# Altium schematic sheet Gating.SchDoc
size A; SheetNumber: 4; SheetTotal: 6
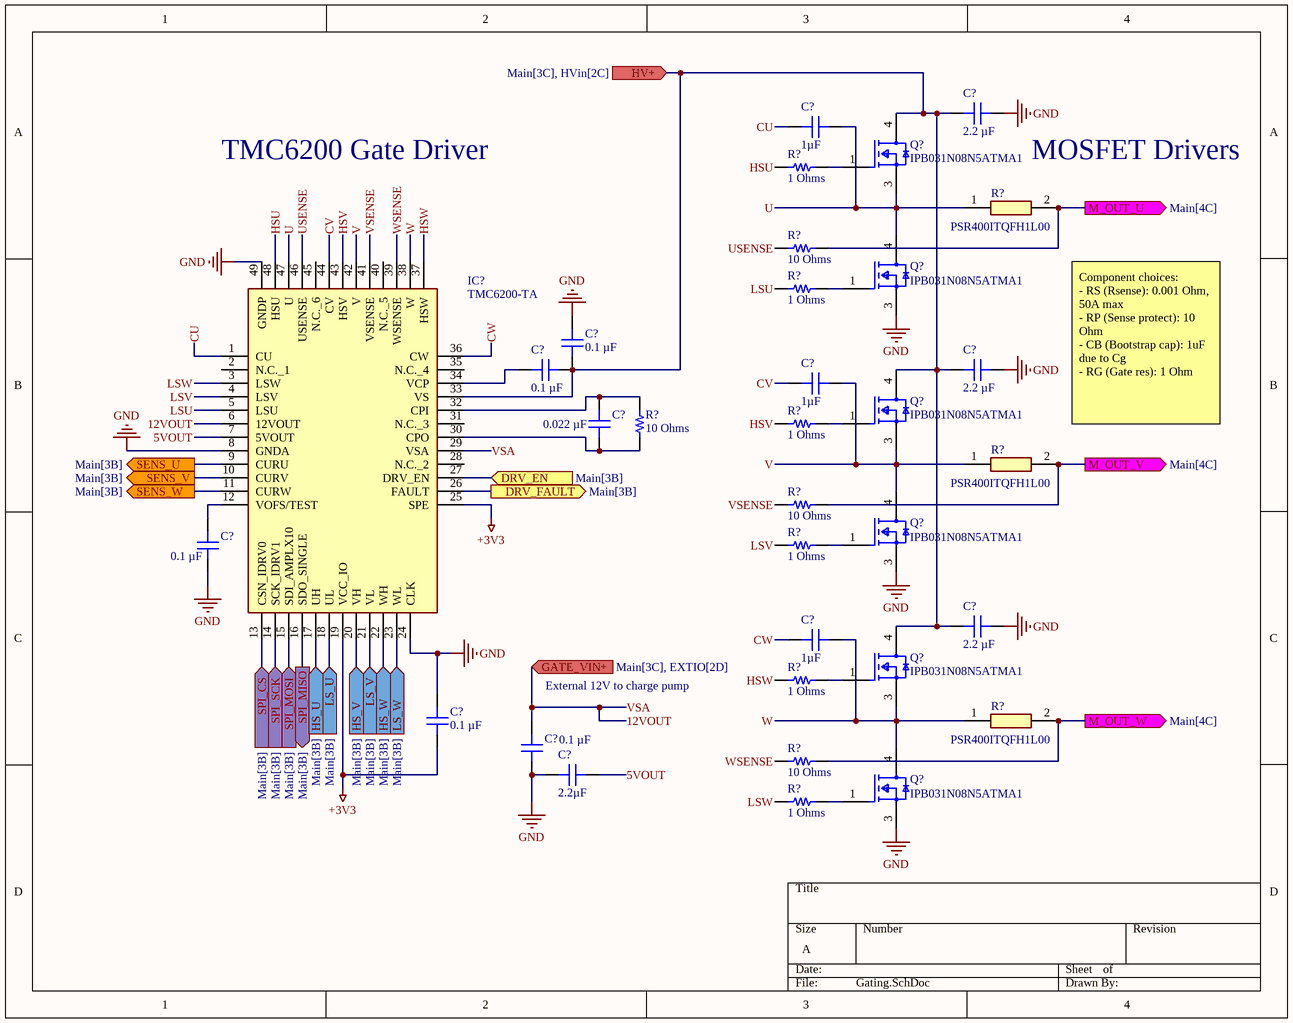
[diagram p0: Gating.SchDoc]

## Parts
(Parts that share a designator on the sheet are numbered #1, #2 ... from top to bottom, then left to right.)
C?#1  2.2 µF  [CAP 0805_2012]
C?#2  1µF  [CAP 1210_3225 - 2.8MM]
C?#3  0.1 µF  [CAP 1206_3216 - 0.8MM]
C?#4  0.1 µF  [CAP 1206_3216 - 0.8MM]
C?#5  2.2 µF  [CAP 0805_2012]
C?#6  1µF  [CAP 1210_3225 - 2.8MM]
C?#7  0.022 µF  [CAP 1206_3216 - 0.8MM]
C?#8  0.1 µF  [CAP 0603_1608]
C?#9  2.2 µF  [CAP 0805_2012]
C?#10  1µF  [CAP 1210_3225 - 2.8MM]
C?#11  0.1 µF  [CAP 0603_1608]
C?#12  0.1 µF  [CAP 1206_3216 - 0.8MM]
C?#13  2.2µF  [CAP 1206_3216 - 1.2MM]
IC?  TMC6200-TA  [QFP50P900X900X120-49N]
Q?#1  IPB031N08N5ATMA1  [FP-PG-TO263-3-MFG]
Q?#2  IPB031N08N5ATMA1  [FP-PG-TO263-3-MFG]
Q?#3  IPB031N08N5ATMA1  [FP-PG-TO263-3-MFG]
Q?#4  IPB031N08N5ATMA1  [FP-PG-TO263-3-MFG]
Q?#5  IPB031N08N5ATMA1  [FP-PG-TO263-3-MFG]
Q?#6  IPB031N08N5ATMA1  [FP-PG-TO263-3-MFG]
R?#1  1 Ohms  [RES 1210_3225]
R?#2  PSR400ITQFH1L00  [RESC10052X105N]
R?#3  10 Ohms  [RES 1210_3225]
R?#4  1 Ohms  [RES 1210_3225]
R?#5  10 Ohms  [RES 0603_1608]
R?#6  1 Ohms  [RES 1210_3225]
R?#7  PSR400ITQFH1L00  [RESC10052X105N]
R?#8  10 Ohms  [RES 1210_3225]
R?#9  1 Ohms  [RES 1210_3225]
R?#10  1 Ohms  [RES 1210_3225]
R?#11  PSR400ITQFH1L00  [RESC10052X105N]
R?#12  10 Ohms  [RES 1210_3225]
R?#13  1 Ohms  [RES 1210_3225]

## Ports
DRV_EN (in, see Main[3B]), DRV_FAULT (out, see Main[3B]), GATE_VIN+ (in, see Main[3C], EXTIO[2D]), HS_U (in, see Main[3B]), HS_V (in, see Main[3B]), HS_W (in, see Main[3B]), HV+ (in, see Main[3C], HVin[2C]), LS_U (in, see Main[3B]), LS_V (in, see Main[3B]), LS_W (in, see Main[3B]), M_OUT_U (out, see Main[4C]), M_OUT_V (out, see Main[4C]), M_OUT_W (out, see Main[4C]), SENS_U (out, see Main[3B]), SENS_V (out, see Main[3B]), SENS_W (out, see Main[3B]), SPI_CS (in, see Main[3B]), SPI_MISO (out, see Main[3B]), SPI_MOSI (in, see Main[3B]), SPI_SCK (in, see Main[3B])

## Nets
+3V3: C?#11.1 IC?.19(VCC_IO) IC?.25(SPE)
GND: C?#1.1 C?#3.2 C?#5.1 C?#8.1 C?#9.1 C?#11.2 C?#12.1 C?#13.1 IC?.8(GNDA) IC?.24(CLK) IC?.49(GNDP) Q?#2.3(S) Q?#4.3(S) Q?#6.3(S)
5VOUT: C?#13.2 IC?.7(5VOUT)
12VOUT: C?#12.2 IC?.6(12VOUT) IC?.29(VSA) ; port GATE_VIN+  [also labelled VSA]
CU: C?#2.1 IC?.1(CU)
CV: C?#6.1 IC?.44(CV)
CW: C?#10.1 IC?.36(CW)
DRV_EN: IC?.27(DRV_EN) ; port DRV_EN
DRV_FAULT: IC?.26(FAULT) ; port DRV_FAULT
HS_U: IC?.17(UH) ; port HS_U
HS_V: IC?.20(VH) ; port HS_V
HS_W: IC?.22(WH) ; port HS_W
HSU: IC?.48(HSU) R?#1.1
HSV: IC?.43(HSV) R?#6.1
HSW: IC?.37(HSW) R?#10.1
HV+: C?#1.2 C?#3.1 C?#4.2 C?#5.2 C?#9.2 IC?.33(VS) Q?#1.4(D) Q?#3.4(D) Q?#5.4(D) ; port HV+
LS_U: IC?.18(UL) ; port LS_U
LS_V: IC?.21(VL) ; port LS_V
LS_W: IC?.23(WL) ; port LS_W
LSU: IC?.5(LSU) R?#4.1
LSV: IC?.4(LSV) R?#9.1
LSW: IC?.3(LSW) R?#13.1
M_OUT_U: R?#2.2 R?#3.2 ; port M_OUT_U
M_OUT_V: R?#7.2 R?#8.2 ; port M_OUT_V
M_OUT_W: R?#11.2 R?#12.2 ; port M_OUT_W
SENS_U: IC?.9(CURU) ; port SENS_U
SENS_V: IC?.10(CURV) ; port SENS_V
SENS_W: IC?.11(CURW) ; port SENS_W
SPI_CS: IC?.13(CSN_IDRV0) ; port SPI_CS
SPI_MISO: IC?.16(SDO_SINGLE) ; port SPI_MISO
SPI_MOSI: IC?.15(SDI_AMPLX10) ; port SPI_MOSI
SPI_SCK: IC?.14(SCK_IDRV1) ; port SPI_SCK
U: C?#2.2 IC?.47(U) Q?#1.3(S) Q?#2.4(D) R?#2.1
USENSE: IC?.46(USENSE) R?#3.1
V: C?#6.2 IC?.42(V) Q?#3.3(S) Q?#4.4(D) R?#7.1
VSENSE: IC?.41(VSENSE) R?#8.1
W: C?#10.2 IC?.38(W) Q?#5.3(S) Q?#6.4(D) R?#11.1
WSENSE: IC?.39(WSENSE) R?#12.1
NetC?#4_1: C?#4.1 IC?.34(VCP)
NetC?#7_1: C?#7.1 IC?.30(CPO) R?#5.1
NetC?#7_2: C?#7.2 IC?.32(CPI) R?#5.2
NetC?#8_2: C?#8.2 IC?.12(VOFS/TEST)
NetQ?#1_1: Q?#1.1(G) R?#1.2
NetQ?#2_1: Q?#2.1(G) R?#4.2
NetQ?#3_1: Q?#3.1(G) R?#6.2
NetQ?#4_1: Q?#4.1(G) R?#9.2
NetQ?#5_1: Q?#5.1(G) R?#10.2
NetQ?#6_1: Q?#6.1(G) R?#13.2

Not connected (* = marked no-connect by the designer): IC? 2(N.C._1) 28(N.C._2) 31(N.C._3) 35(N.C._4) 40(N.C._5) 45(N.C._6)

## Notes on the sheet
- TMC6200 Gate Driver
- MOSFET Drivers
- Component choices:
  - RS (Rsense): 0.001 Ohm, 50A max
  - RP (Sense protect): 10 Ohm
  - CB (Bootstrap cap): 1uF due to Cg
  - RG (Gate res): 1 Ohm
- (near C?#12) External 12V to charge pump

## Library data of the parts
C?#1 C?#5 C?#9 = GRM21BD72A225KE01L: CAP CER 2.2UF 100V X7T 0805; manufacturer: Murata Electronics; Tolerance: ±10%; Part Number: GRM21BD72A225KE01L; Value: 2.2 µF; Applications: General Purpose; Capacitance: 2.2 µF; componentlink1description: Datasheet; componentlink1url: https://search.murata.co.jp/Ceramy/image/img/A01X/G101/ENG/GRM21BD72A225KE01-01A.pdf; componentlink2description: DigiKey Link; componentlink2url: https://www.digikey.com/en/products/detail/murata-electronics/GRM21BD72A225KE01L/16033492; Device Package: 0805 (2012 Metric); lastupdated: 2/6/2023 8:10:57 PM; Lifecycle Status: Active; Minimum Order: 1; Mounting Type: Surface Mount, MLCC; Operating Temperature: -55°C ~ 125°C; Package / Case: 0805 (2012 Metric); packaging: TapeAndReel; partid: 42420; Part Status: Active; price: 0.13; series: GRM; Size / Dimension: 0.079" L x 0.049" W (2.00mm x 1.25mm); Supplier 1: DigiKey; Supplier Part Number 1: 490-GRM21BD72A225KE01LCT-ND; Temperature Coefficient: X7T; Thickness (Max): 0.057" (1.45mm); Voltage - Rated: 100V
C?#2 C?#6 C?#10 = 12101C105MAT2A: CAP CER 1UF 100V X7R 1210; manufacturer: AVX Corporation; Tolerance: ±20%; Part Number: 12101C105MAT2A; Value: 1µF; Applications: General Purpose; Capacitance: 1µF; componentlink1description: Datasheet; componentlink1url: http://datasheets.avx.com/X7RDielectric.pdf; componentlink2description: DigiKey Link; componentlink2url: http://digikey.com/product-detail/en/avx-corporation/12101C105MAT2A/478-2571-1-ND/717516; Device Package: 1210 (3225 Metric); lastupdated: 9/2/2020 1:10:52 AM; Lifecycle Status: Active; Minimum Order: 1; Mounting Type: Surface Mount, MLCC; Operating Temperature: -55°C ~ 125°C; Package / Case: 1210 (3225 Metric); packaging: TapeAndReel; partid: 23736; Part Status: Active; price: 0.21; series: -; Size / Dimension: 0.126" L x 0.098" W (3.20mm x 2.50mm); Supplier 1: DigiKey; Supplier Part Number 1: 478-2571-1-ND; Temperature Coefficient: X7R; Thickness (Max): 0.110" (2.79mm); Voltage - Rated: 100V
C?#3 C?#4 C?#12 = CC1206MRY5V9BB104: CAP CER 0.1UF 50V Y5V 1206; manufacturer: Yageo; Temperature Coefficient: Y5V (F); Tolerance: ±20%; Part Number: CC1206MRY5V9BB104; Value: 0.1 µF; Applications: General Purpose; Capacitance: 0.1 µF; componentlink1description: Datasheet; componentlink1url: http://www.yageo.com/documents/recent/UPY-GPHC_Y5V_6.3V-to-50V_8.pdf; componentlink2description: DigiKey Link; componentlink2url: https://www.digikey.com/en/products/detail/yageo/CC1206MRY5V9BB104/5884674; Device Package: 1206 (3216 Metric); lastupdated: 2/6/2023 8:14:35 PM; Lifecycle Status: Active; Minimum Order: 1; Mounting Type: Surface Mount, MLCC; Operating Temperature: -30°C ~ 85°C; Package / Case: 1206 (3216 Metric); packaging: TapeAndReel; partid: 18711; Part Status: Active; price: 0.05; series: CC; Size / Dimension: 0.126" L x 0.063" W (3.20mm x 1.60mm); Supplier 1: DigiKey; Supplier Part Number 1: 311-4504-1-ND; Thickness (Max): 0.028" (0.70mm); Voltage - Rated: 50V
C?#7 = C1206C223K1RECAUTO: CAP CER 1206 22NF 100V X7R 10%; manufacturer: KEMET; Part Number: C1206C223K1RECAUTO; Value: 0.022 µF; Applications: Automotive, ESD Protection; Capacitance: 0.022 µF; componentlink1description: Datasheet; componentlink1url: https://api.kemet.com/component-edge/download/datasheet/C1206C223K1RECAUTO.pdf; componentlink2description: DigiKey Link; componentlink2url: https://www.digikey.com/en/products/detail/kemet/C1206C223K1RECAUTO/8640492; Device Package: 1206 (3216 Metric); lastupdated: 2/6/2023 8:14:07 PM; Lifecycle Status: Active; Minimum Order: 1; Mounting Type: Surface Mount, MLCC; Operating Temperature: -55°C ~ 125°C; Package / Case: 1206 (3216 Metric); packaging: TapeAndReel; partid: 21022; Part Status: Active; price: 0.03; Ratings: AEC-Q200; series: ESD SMD Auto X7R; Size / Dimension: 0.126" L x 0.063" W (3.20mm x 1.60mm); Supplier 1: DigiKey; Supplier Part Number 1: 399-17898-1-ND; Temperature Coefficient: X7R; Thickness (Max): 0.035" (0.88mm); Tolerance: ±10%; Voltage - Rated: 100V
C?#8 C?#11 = CS0603KRX7R7BB104: CAP CER 0.1UF 16V X7R 0603; manufacturer: Yageo; Tolerance: ±10%; Part Number: CS0603KRX7R7BB104; Value: 0.1 µF; Applications: Boardflex Sensitive; Capacitance: 0.1 µF; componentlink1description: Datasheet; componentlink1url: http://www.yageo.com/NewPortal/yageodocoutput?fileName=/pdf/MLCC/UPY-ST_NPOX7R_16V-to-3KV_5.pdf; componentlink2description: DigiKey Link; componentlink2url: https://www.digikey.com/en/products/detail/yageo/CS0603KRX7R7BB104/6097897; Device Package: 0603 (1608 Metric); Features: Soft Termination; lastupdated: 2/6/2023 8:08:52 PM; Lifecycle Status: Active; Minimum Order: 1; Mounting Type: Surface Mount, MLCC; Operating Temperature: -55°C ~ 125°C; Package / Case: 0603 (1608 Metric); packaging: TapeAndReel; partid: 2286; Part Status: Active; price: 0.01; series: CS; Size / Dimension: 0.063" L x 0.031" W (1.60mm x 0.80mm); Supplier 1: DigiKey; Supplier Part Number 1: 311-3560-1-ND; Temperature Coefficient: X7R; Thickness (Max): 0.037" (0.95mm); Voltage - Rated: 16V
C?#13 = 12063G225ZAT4A: CAP CER 2.2UF 25V Y5V 1206; manufacturer: AVX Corporation; Temperature Coefficient: Y5V (F); Tolerance: -20%, +80%; Part Number: 12063G225ZAT4A; Value: 2.2µF; Applications: General Purpose; Capacitance: 2.2µF; componentlink1description: Datasheet; componentlink1url: http://datasheets.avx.com/Y5V.pdf; componentlink2description: DigiKey Link; componentlink2url: http://digikey.com/product-detail/en/avx-corporation/12063G225ZAT4A/478-12479-1-ND/9749331; Device Package: 1206 (3216 Metric); lastupdated: 9/2/2020 1:05:10 AM; Lifecycle Status: Active; Minimum Order: 1; Mounting Type: Surface Mount, MLCC; Operating Temperature: -30°C ~ 85°C; Package / Case: 1206 (3216 Metric); packaging: TapeAndReel; partid: 18984; Part Status: Active; price: 0.09; series: -; Size / Dimension: 0.126" L x 0.063" W (3.20mm x 1.60mm); Supplier 1: DigiKey; Supplier Part Number 1: 478-12479-1-ND; Thickness (Max): 0.040" (1.02mm); Voltage - Rated: 25V
IC? = TMC6200-TA: Integrated Circuit; Manufacturer_Name: Trinamic Motion Control GmbH; Datasheet Link: https://datasheet.datasheetarchive.com/originals/distributors/Datasheets_SAMA/f9acd441643b32190a486ba2a99356a2.pdf; Height: 1.2mm; Manufacturer_Part_Number: TMC6200-TA
Q?#1-Q?#6 = CMP-32901-001127-1: MOSFET N-CH 80V 120A D2PAK; Element Configuration: Single; Gate to Source Voltage (Vgs): 20V; Rise Time: 18ns; Rds On Max: 3.1mR; Drain to Source Resistance: 4.1mR; Number of Channels: 1; Fall Time: 12ns; Max Power Dissipation: 167W; Turn-Off Delay Time: 37ns; Polarity: N-CHANNEL; Input Capacitance: 6.24nF; Max Operating Temperature: 175°C; Packaging: Tape and Reel; Package Quantity: 1000; Lead Free: Contains Lead; Min Operating Temperature: -55°C; Drain to Source Voltage (Vdss): 80V; Mount: Surface Mount; Max Dual Supply Voltage: 80V; RoHS Compliant: Yes; Weight: 0.139332oz; Turn-On Delay Time: 18ns; Halogen Free: Halogen Free; Drain to Source Breakdown Voltage: 80V; Series: OptiMOS™; Case/Package: TO-263-3; Continuous Drain Current (ID): 120A; Number of Pins: 3
R?#1 R?#4 R?#6 R?#9 R?#10 R?#13 = RK73B2ETTD1R0J: RES 1 OHM 5% 1/2W 1210; Manufacturer: KOA Speer Electronics, Inc.; Power (Watts): 0.5W, 1/2W; Temperature Coefficient: ±200ppm/°C; Part Number: RK73B2ETTD1R0J; ComponentLink1Description: Datasheet; ComponentLink1URL: http://www.koaspeer.com/catimages/Products/RK73B/RK73B.pdf; ComponentLink2Description: DigiKey Link; ComponentLink2URL: https://www.digikey.com/en/products/detail/koa-speer-electronics-inc/RK73B2ETTD1R0J/10315032; Composition: Thick Film; Device Package: 1210 (3225 Metric); Features: Automotive AEC-Q200; Height - Seated (Max): 0.028" (0.70mm); LastUpdated: 2/6/2023 9:02:08 PM; Lifecycle Status: Active; Minimum Order: 1; Number of Terminations: 2; Operating Temperature: -55°C ~ 155°C; Package / Case: 1210 (3225 Metric); Packaging: TapeAndReel; Part Status: Active; Price: 0.02; Ratings: AEC-Q200; Resistance: 1 Ohms; Series: RK73B; Size / Dimension: 0.126" L x 0.063" W (3.20mm x 1.60mm); Supplier 1: DigiKey; Supplier Part Number 1: 2019-RK73B2ETTD1R0JCT-ND; Supplier Device Package: 1210; Tolerance: ±5%; Value: 1 Ohms
R?#2 R?#7 R?#11 = PSR400ITQFH1L00: Resistor; Manufacturer_Name: ROHM Semiconductor; Datasheet Link: https://datasheet.datasheetarchive.com/originals/distributors/DKDS-18/356551.pdf; Height: 1.05mm; Manufacturer_Part_Number: PSR400ITQFH1L00; Mouser Part Number: 755-PSR400ITQFH1L00; Mouser Price/Stock: https://www.mouser.co.uk/ProductDetail/ROHM-Semiconductor/PSR400ITQFH1L00?qs=493kPxzlxfKMrnsSE5rdTg%3D%3D
R?#3 R?#8 R?#12 = RN73R2ETTD10R0F25: RESISTOR THIN FILM 1210 SIZE; Manufacturer: KOA Speer Electronics, Inc.; Power (Watts): 0.25W, 1/4W; Temperature Coefficient: ±25ppm/°C; Tolerance: ±1%; Part Number: RN73R2ETTD10R0F25; ComponentLink1Description: Datasheet; ComponentLink1URL: https://www.koaspeer.com/pdfs/RN73R.pdf; ComponentLink2Description: DigiKey Link; ComponentLink2URL: https://www.digikey.com/en/products/detail/koa-speer-electronics-inc/RN73R2ETTD10R0F25/13211390; Composition: Metal Film; Device Package: 1210 (3225 Metric); Features: Automotive AEC-Q200, Moisture Resistant; Height - Seated (Max): 0.028" (0.70mm); LastUpdated: 2/6/2023 9:02:05 PM; Lifecycle Status: Active; Minimum Order: 1; Number of Terminations: 2; Operating Temperature: -55°C ~ 155°C; Package / Case: 1210 (3225 Metric); Packaging: TapeAndReel; Part Status: Active; Price: 0.16; Ratings: AEC-Q200; Resistance: 10 Ohms; Series: RN73R; Size / Dimension: 0.126" L x 0.098" W (3.20mm x 2.50mm); Supplier 1: DigiKey; Supplier Part Number 1: 2019-RN73R2ETTD10R0F25CT-ND; Supplier Device Package: 1210; Value: 10 Ohms
R?#5 = CPF0603B10RE: RES SMD 10 OHM 0.1% 1/16W 0603; Manufacturer: TE Connectivity Passive Product; Power (Watts): 0.063W, 1/16W; Temperature Coefficient: ±25ppm/°C; Part Number: CPF0603B10RE; Value: 10 Ohms; ComponentLink1Description: Datasheet; ComponentLink1URL: https://www.te.com/commerce/DocumentDelivery/DDEController?Action=srchrtrv&DocNm=1773200&DocType=DS&DocLang=English; ComponentLink2Description: DigiKey Link; ComponentLink2URL: https://www.digikey.com/en/products/detail/te-connectivity-passive-product/CPF0603B10RE/2381853; Composition: Thin Film; Device Package: 0603 (1608 Metric); Height - Seated (Max): 0.022" (0.55mm); LastUpdated: 2/5/2023 8:28:11 PM; Lifecycle Status: Active; Minimum Order: 1; Number of Terminations: 2; Operating Temperature: -55°C ~ 155°C; Package / Case: 0603 (1608 Metric); Packaging: TapeAndReel; PartId: 4879; Part Status: Active; Price: 0.09; Resistance: 10 Ohms; Series: CPF, Neohm; Size / Dimension: 0.061" L x 0.031" W (1.55mm x 0.80mm); Supplier 1: DigiKey; Supplier Part Number 1: A119908CT-ND; Supplier Device Package: 0603; Tolerance: ±0.1%